# Altium schematic sheet PAYLOAD Subsystem.SchDoc
size A; SheetNumber: 1; SheetTotal: 1
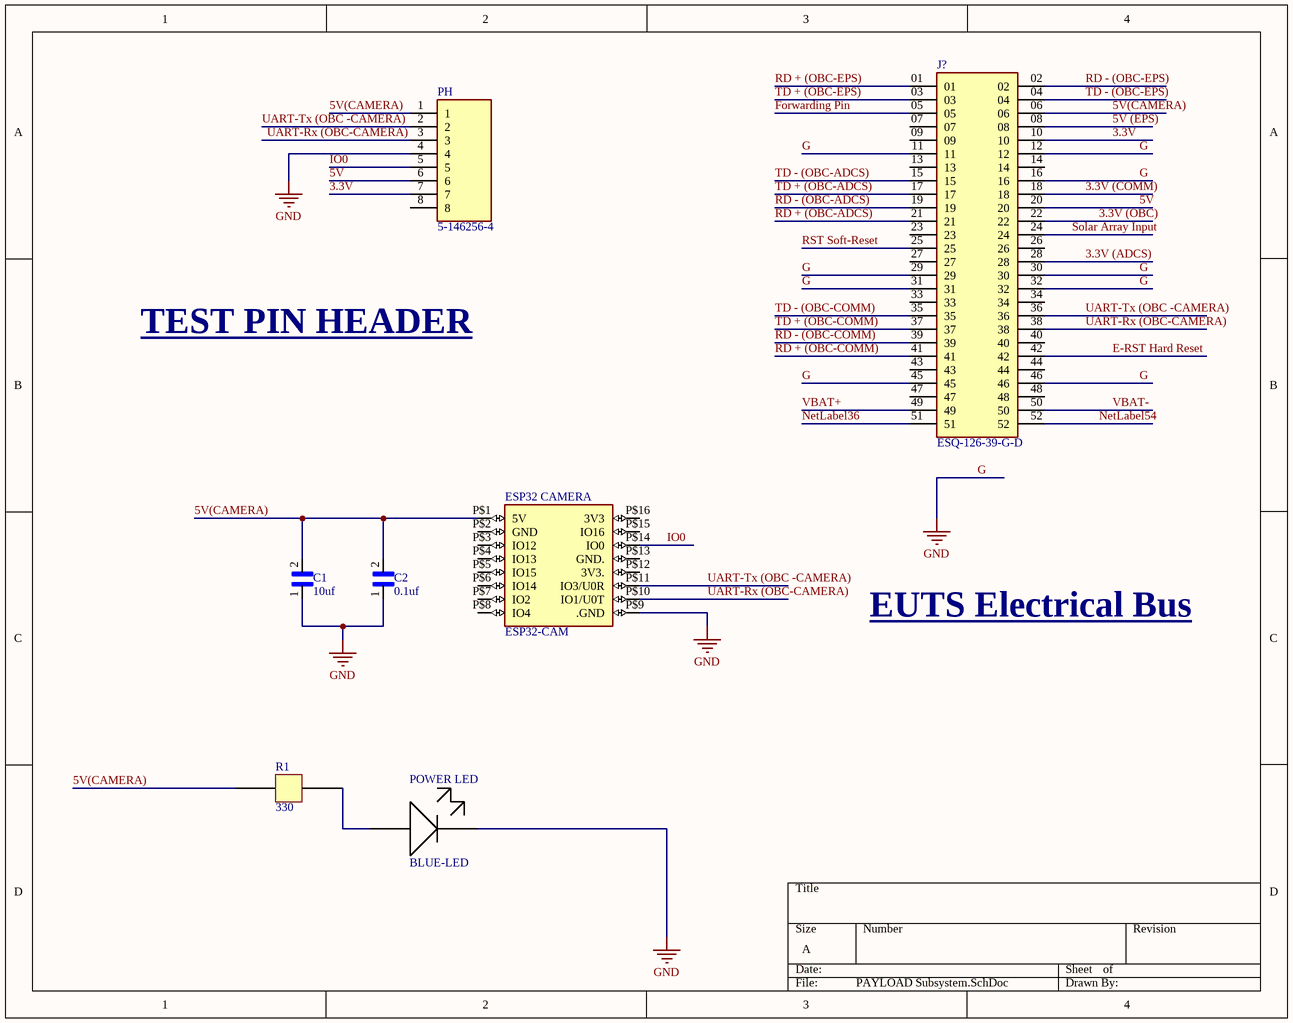
[diagram p0: PAYLOAD Subsystem.SchDoc]

## Parts
C1  10uf  [CAPC2012X95N]
C2  0.1uf  [CAPC2012X95N]
ESP32_CAMERA  ESP32-CAM  [ESP32-CAM]
J?  ESQ-126-39-G-D  [SAMTEC_ESQ-126-39-G-D]
PH  5-146256-4  [TE_5-146256-4]
POWER_LED  BLUE-LED  [RESC3015X65]
R1  330  [CAPC2012X95N]

## Nets
G: C1.1 C2.1 ESP32_CAMERA.P$9(.GND) J?.11 J?.12 J?.16 J?.29 J?.30 J?.31 J?.32 J?.45 J?.46 PH.4 POWER_LED.2  [also labelled GND]
3.3V: J?.10 PH.7
3.3V (ADCS): J?.28
3.3V (COMM): J?.18
3.3V (OBC): J?.22
5V: J?.20 PH.6
5V (EPS): J?.08
5V(CAMERA): C1.2 C2.2 ESP32_CAMERA.P$1(5V) J?.06 PH.1 R1.2
E-RST Hard Reset: J?.42
Forwarding Pin: J?.05
IO0: ESP32_CAMERA.P$14(IO0) PH.5
NetLabel36: J?.51
NetLabel54: J?.52
RD + (OBC-ADCS): J?.21
RD + (OBC-COMM): J?.41
RD + (OBC-EPS): J?.01
RD - (OBC-ADCS): J?.19
RD - (OBC-COMM): J?.39
RD - (OBC-EPS): J?.02
RST Soft-Reset: J?.25
Solar Array Input: J?.24
TD + (OBC-ADCS): J?.17
TD + (OBC-COMM): J?.37
TD + (OBC-EPS): J?.03
TD - (OBC-ADCS): J?.15
TD - (OBC-COMM): J?.35
TD - (OBC-EPS): J?.04
UART-Rx (OBC-CAMERA): ESP32_CAMERA.P$10(IO1/U0T) J?.38 PH.3
UART-Tx (OBC -CAMERA): ESP32_CAMERA.P$11(IO3/U0R) J?.36 PH.2
VBAT+: J?.49
VBAT-: J?.50
NetPOWER_LED_1: POWER_LED.1 R1.1

Not connected (* = marked no-connect by the designer): ESP32_CAMERA P$2(GND) P$3(IO12) P$4(IO13) P$5(IO15) P$6(IO14) P$7(IO2) P$8(IO4) P$12(3V3.) P$13(GND.) P$15(IO16) P$16(3V3); J? 07 09 13 14 23 26 27 33 34 40 43 44 47 48; PH 8

## Notes on the sheet
- TEST PIN HEADER
- EUTS Electrical Bus

## Library data of the parts
C1 C2 = UMK212SD103KD-T: CAP CER 10000PF 50V 0805; Package: None; Price: None; Value: *; MP: UMK212SD103KD-T; Availability: Unavailable
ESP32_CAMERA = ESP32-CAM: The smallest 802.11b/g/n Wi-Fi BT SoC Module; MF: AI-Thinker; Price: None; Value: *; Check_prices: https://www.snapeda.com/parts/ESP32-CAM/AI-Thinker/view-part/5507632/?ref=eda; Package: Package; Availability: No availability data; MP: ESP32-CAM; SnapEDA_Link: https://www.snapeda.com/parts/ESP32-CAM/AI-Thinker/view-part/5507632/?ref=snap
J? = ESQ-126-39-G-D: 52 Position Elevated Socket Connector Through Hole; MF: Samtec; Package: None; MP: ESQ-126-39-G-D; Value: *; Availability: Unavailable; Price: None; SnapEDA_Link: https://www.snapeda.com/parts/ESQ-126-39-G-D/Samtec%20Inc./view-part/490181/?ref=snap
PH = 5-146256-4: 08 MODII HDR DRST B/A .100CL LF; MF: TE Connectivity; Package: None; Availability: Unavailable; Value: *; MP: 5-146256-4; Price: None; SnapEDA_Link: https://www.snapeda.com/parts/5-146256-4/TE%20Connectivity%20AMP%20Connectors/view-part/500529/?ref=snap
POWER_LED = LTST-C150TBKT: LED Blue 470nm LED Indication 3.3V
R1 = RESISTOR